# EAGLE schematic untitled (EAGLE 7.5.0)
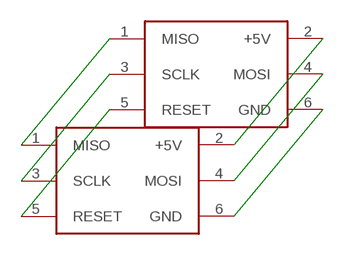
[diagram p0: schematic, sheet 1]

## Parts
U$1  ICSP  [ICSP]
U$2  ICSP_SPRING  [ICSP_SPRING]

## Nets
N$1: U$1.3(SCLK) U$2.3(SCLK)
N$2: U$1.5(RESET) U$2.5(RESET)
N$3: U$1.1(MISO) U$2.1(MISO)
N$4: U$1.2(+5V) U$2.2(+5V)
N$5: U$1.4(MOSI) U$2.4(MOSI)
N$6: U$1.6(GND) U$2.6(GND)

## Library data of the parts
U$1 = 08_CONECTOR:ICSP
U$2 = 08_CONECTOR:ICSP_SPRING